# EAGLE design Simple-Transmitter-BC547 (EAGLE 7.6.0)
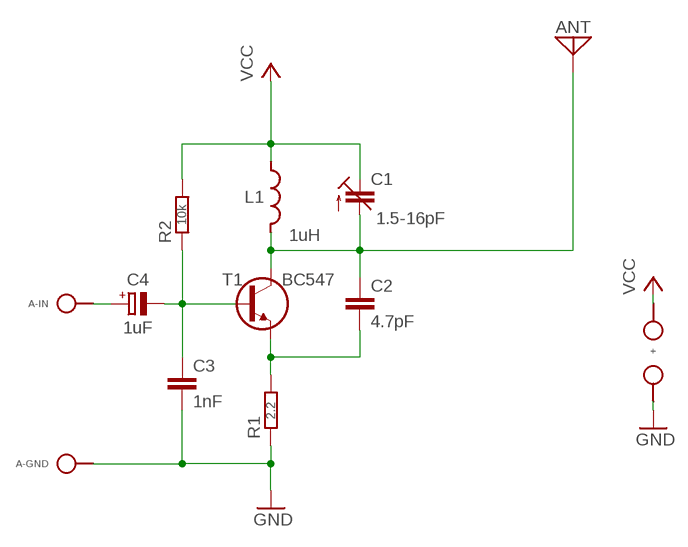
[diagram p0: schematic, sheet 1]

## Parts
+  SPAD  [SPAD]
A-GND  SPAD  [SPAD]
A-IN  SPAD  [SPAD]
ANT  ANT  [SPAD]
C1  1.5-16pF  C-TR-PH20127-45-2P23  [TRIM808-45]
C2  4.7pF  C050-020X036-M  [C050-020X036-M]
C3  1nF  C050-020X036  [C050-020X036]
C4  1uF  CPOLE2,5-3  [E2,5-3]
L1  1uH  L-SHORT04/7  [L-04/7]
R1  2.2  R0202V  [0202V]
R2  10k  R0202/5-V  [0202/5-V]
T1  BC547  BC547CBE  [TO92-CBE]
̶̶  SPAD  [SPAD]

## Nets
AIN: A-IN.1 C4.+
GND: A-GND.1 C3.2 R1.1 ̶̶.1
N$1: ANT.1 C1.2(E) C2.1 L1.2 T1.C
N$3: C2.2 R1.2 T1.E
N$5: C3.1 C4.- R2.1 T1.B
VCC: +.1 C1.3(A) L1.1 R2.2

## Library data of the parts
+ A-GND A-IN ̶̶ = pad:SPAD
ANT = pad:ANT
C1 = cap-trim:C-TR-PH20127
C2 C3 = c:C: CAPACITOR, European symbol
C4 = c:CPOL: POLARIZED CAPACITOR, European symbol
L1 = r:L-SHORT
R1 R2 = r:R: RESISTOR, European symbol
T1 = t:BC547

## Net classes
0 default: width 0.406 mm

## Board
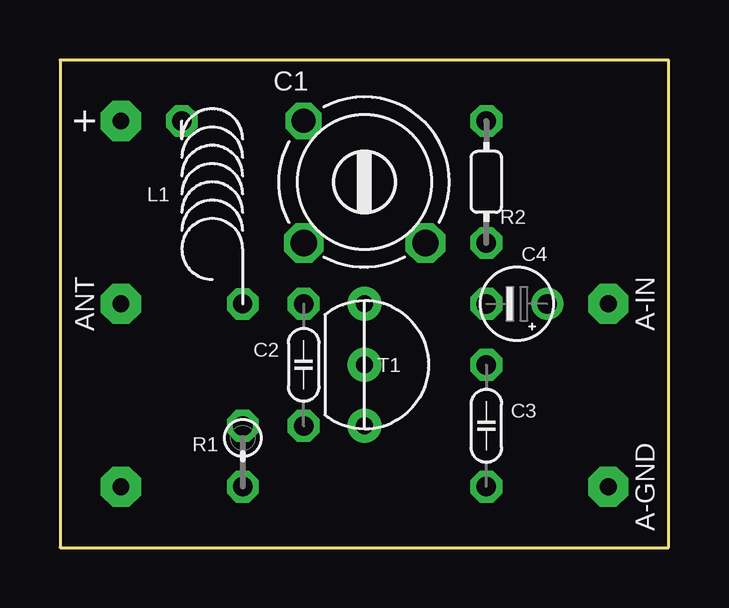
[diagram p1: board, top side]
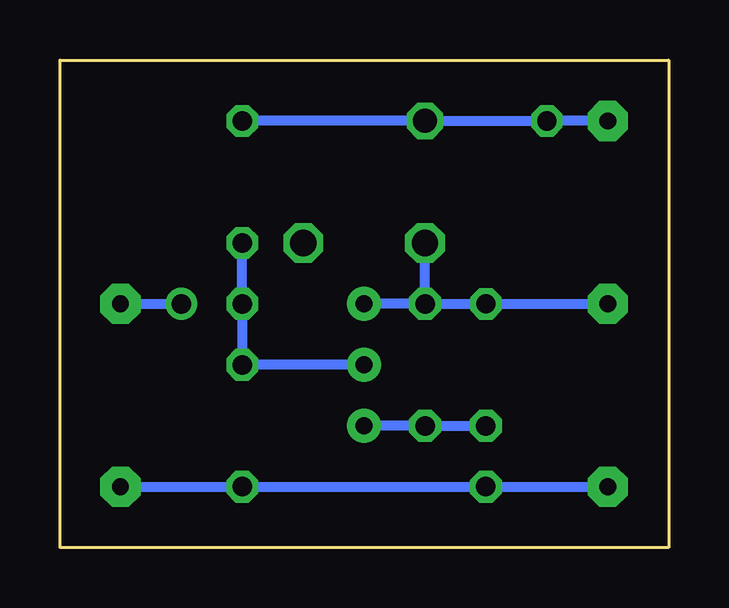
[diagram p2: board, bottom side, seen from below]

Size 25.38 x 20.32 mm. Coordinates in mm from the lower left corner, seen from the top.
Outline: 0,0 25.38,0 25.38,20.32 0,20.32 0,0
Copper layers (1*16): Top 0.035mm / dielectric 1.5mm / Bottom 0.035mm
Design rules "default": minimum track width 10mil, minimum drill 24mil, track to track 8mil, track to pad 8mil, pad to pad 8mil, via to via 8mil, smd to smd 8mil, copper to edge 40mil, drill to drill 8mil, minimum pad ring 10mil, minimum via ring 8mil, stop-mask expansion 4mil, vias tented up to drill 0mil, thermal gap 10mil

### Footprints (pad centres in the part's own frame; a part is rotated, then mirrored left to right if it is on the bottom)
SPAD = drill 0.7 pad 1.676 octagon: 1 0,0
TRIM808-45 = drill 1.1 octagon: 1 2.54,-2.54; 2 -2.54,-2.54 | drill 1 octagon: 3 -2.54,2.54
C050-020X036-M = drill 0.813 octagon: 1 0,2.54; 2 0,-2.54
C050-020X036 = drill 0.813 octagon: 1 0,2.54; 2 0,-2.54
E2,5-3 = drill 0.813: + 1.27,0 | drill 0.813 octagon: - -1.27,0
L-04/7 = drill 0.8 octagon: 1 -1.27,3.81; 2 1.27,-3.81
0202V = drill 0.813 octagon: 1 0,-1.27; 2 0,1.27
0202/5-V = drill 0.813 octagon: 1 0,2.54; 2 0,-2.54
TO92-CBE = drill 0.7 pad 1.422: B 0,0; C 0,2.54; E 0,-2.54

### Placement (x,y rotation side)
+  2.54,17.78 180 top
A-GND  22.86,2.54 0 top
A-IN  22.86,10.16 0 top
ANT  2.54,10.16 180 top
C1  12.7,15.24 0 top
C2  10.16,7.62 0 top
C3  17.78,5.08 0 top
C4  19.05,10.16 0 top
L1  6.35,13.97 0 top
R1  7.62,3.81 0 top
R2  17.78,15.24 180 top
T1  12.7,7.62 0 top
̶̶  2.54,2.54 180 top

### Tracks (layer width: path | path; a pad name or v marks a point on that pad's centre or on a via)
AIN
  Bottom 0.406: A-IN.1 C4.+
GND
  Bottom 0.406: A-GND.1 C3.2 R1.1 ̶̶.1
N$1
  Bottom 0.406: C2.1 L1.2 ANT.1 | C2.1 T1.C | C2.1 C1.2
N$3
  Bottom 0.406: R1.2 C2.2 T1.E
N$5
  Bottom 0.406: T1.B C3.1 C4.- R2.1
VCC
  Bottom 0.406: +.1 L1.1 C1.3 R2.2